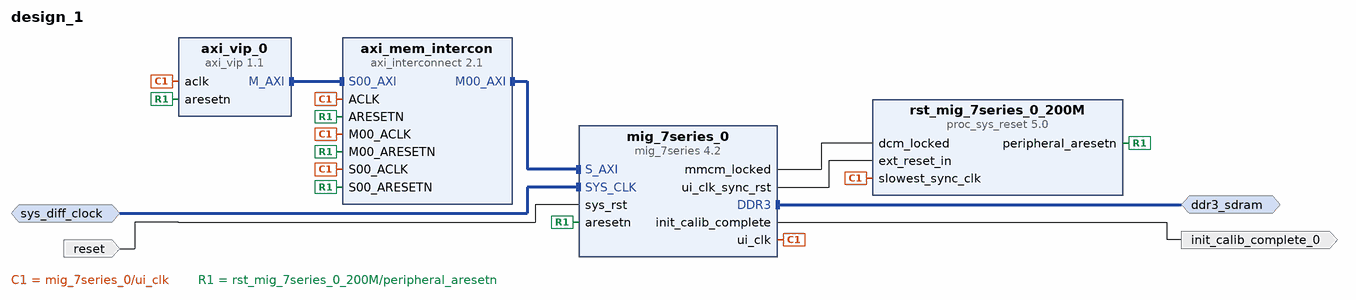
[diagram p0: block diagram of the top level]
# Vivado block design design_1, xc7k325tffg900-2, Vivado 2019.1
create_bd_design design_1

create_bd_intf_port -mode Master -vlnv xilinx.com:interface:ddrx_rtl:1.0 ddr3_sdram
create_bd_intf_port -mode Slave -vlnv xilinx.com:interface:diff_clock_rtl:1.0 sys_diff_clock
set_property -dict {CONFIG.FREQ_HZ 100000000} [get_bd_intf_ports sys_diff_clock]
create_bd_port -dir I -type rst reset
set_property -dict {CONFIG.POLARITY ACTIVE_HIGH} [get_bd_ports reset]
create_bd_port -dir O init_calib_complete_0

create_bd_cell -type ip -vlnv xilinx.com:ip:mig_7series:4.2 mig_7series_0
set_property -dict {CONFIG.BOARD_MIG_PARAM ddr3_sdram CONFIG.RESET_BOARD_INTERFACE reset} [get_bd_cells mig_7series_0]
create_bd_cell -type ip -vlnv xilinx.com:ip:axi_vip:1.1 axi_vip_0
set_property -dict [list \
  CONFIG.ADDR_WIDTH 32 \
  CONFIG.ARUSER_WIDTH 0 \
  CONFIG.AWUSER_WIDTH 0 \
  CONFIG.BUSER_WIDTH 0 \
  CONFIG.DATA_WIDTH 512 \
  CONFIG.HAS_BRESP 1 \
  CONFIG.HAS_BURST 1 \
  CONFIG.HAS_CACHE 1 \
  CONFIG.HAS_LOCK 1 \
  CONFIG.HAS_PROT 1 \
  CONFIG.HAS_QOS 1 \
  CONFIG.HAS_REGION 1 \
  CONFIG.HAS_RRESP 1 \
  CONFIG.HAS_SIZE 1 \
  CONFIG.HAS_WSTRB 1 \
  CONFIG.ID_WIDTH 0 \
  CONFIG.INTERFACE_MODE MASTER \
  CONFIG.PROTOCOL AXI4 \
  CONFIG.READ_WRITE_MODE READ_WRITE \
  CONFIG.RUSER_BITS_PER_BYTE 0 \
  CONFIG.RUSER_WIDTH 0 \
  CONFIG.SUPPORTS_NARROW 1 \
  CONFIG.WUSER_BITS_PER_BYTE 0 \
  CONFIG.WUSER_WIDTH 0 \
] [get_bd_cells axi_vip_0]
create_bd_cell -type ip -vlnv xilinx.com:ip:axi_interconnect:2.1 axi_mem_intercon
set_property -dict {CONFIG.NUM_MI 1} [get_bd_cells axi_mem_intercon]
create_bd_cell -type ip -vlnv xilinx.com:ip:proc_sys_reset:5.0 rst_mig_7series_0_200M

# ---- connections ----

connect_bd_intf_net [get_bd_intf_ports ddr3_sdram] [get_bd_intf_pins mig_7series_0/DDR3]
connect_bd_intf_net [get_bd_intf_pins axi_mem_intercon/M00_AXI] [get_bd_intf_pins mig_7series_0/S_AXI]
connect_bd_intf_net [get_bd_intf_ports sys_diff_clock] [get_bd_intf_pins mig_7series_0/SYS_CLK]
connect_bd_intf_net [get_bd_intf_pins axi_vip_0/M_AXI] [get_bd_intf_pins axi_mem_intercon/S00_AXI]
connect_bd_net [get_bd_pins mig_7series_0/ui_clk] \
  [get_bd_pins axi_mem_intercon/ACLK] [get_bd_pins axi_vip_0/aclk] [get_bd_pins axi_mem_intercon/S00_ACLK] \
  [get_bd_pins rst_mig_7series_0_200M/slowest_sync_clk] [get_bd_pins axi_mem_intercon/M00_ACLK]
connect_bd_net [get_bd_pins mig_7series_0/mmcm_locked] [get_bd_pins rst_mig_7series_0_200M/dcm_locked]
connect_bd_net [get_bd_pins mig_7series_0/ui_clk_sync_rst] [get_bd_pins rst_mig_7series_0_200M/ext_reset_in]
connect_bd_net [get_bd_pins rst_mig_7series_0_200M/peripheral_aresetn] \
  [get_bd_pins axi_vip_0/aresetn] [get_bd_pins axi_mem_intercon/S00_ARESETN] [get_bd_pins mig_7series_0/aresetn] \
  [get_bd_pins axi_mem_intercon/M00_ARESETN] [get_bd_pins axi_mem_intercon/ARESETN]
connect_bd_net [get_bd_ports reset] [get_bd_pins mig_7series_0/sys_rst]
connect_bd_net [get_bd_pins mig_7series_0/init_calib_complete] [get_bd_ports init_calib_complete_0]

# ---- address map ----
assign_bd_address -offset 0x80000000 -range 1G -target_address_space [get_bd_addr_spaces axi_vip_0/Master_AXI] [get_bd_addr_segs mig_7series_0/memmap/memaddr]

validate_bd_design
save_bd_design
